# Altium project Vertical.PrjPCB
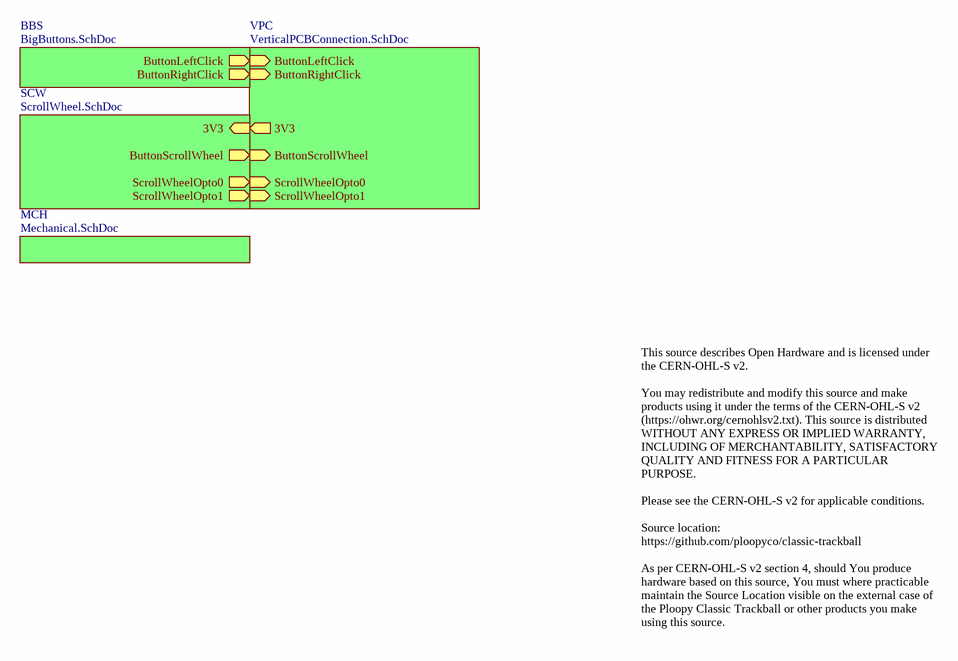
[diagram p0: Vertical.SchDoc]
5 sheets, 36 parts. Net scope: hierarchical (ports join the sheet entries above them; power ports are global).
Board file: Vertical.PcbDoc
Sheets:
  Vertical.SchDoc
    MCH = Mechanical.SchDoc
    VPC = VerticalPCBConnection.SchDoc
    BBS = BigButtons.SchDoc
    SCW = ScrollWheel.SchDoc

## Sheet Vertical.SchDoc
size Letter; Organization: Ploopy Corporation; Address1: 137-1140 Burnhamthorpe Road W; Address3: Ontario; DocumentNumber: 1; Revision: R1.007; SheetNumber: 1; SheetTotal: 5

### Sub-sheets
BBS = BigButtons.SchDoc: ButtonRightClick (out), ButtonLeftClick (out)
MCH = Mechanical.SchDoc: no entries
SCW = ScrollWheel.SchDoc: 3V3 (in), ScrollWheelOpto1 (out), ScrollWheelOpto0 (out), ButtonScrollWheel (out)
VPC = VerticalPCBConnection.SchDoc: 3V3 (out), ButtonRightClick (in), ButtonLeftClick (in), ScrollWheelOpto1 (in), ScrollWheelOpto0 (in), ButtonScrollWheel (in)

### Nets
3V3: sheet VPC/3V3, sheet SCW/3V3
NetCJ2_1: sheet VPC/ButtonScrollWheel, sheet SCW/ButtonScrollWheel
NetCJ3_1: sheet VPC/ScrollWheelOpto0, sheet SCW/ScrollWheelOpto0
NetCJ4_1: sheet VPC/ScrollWheelOpto1, sheet SCW/ScrollWheelOpto1
NetCJ6_1: sheet VPC/ButtonLeftClick, sheet BBS/ButtonLeftClick
NetCJ7_1: sheet VPC/ButtonRightClick, sheet BBS/ButtonRightClick

### Notes on the sheet
- This source describes Open Hardware and is licensed under the CERN-OHL-S v2.
  You may redistribute and modify this source and make products using it under the terms of the CERN-OHL-S v2 (https://ohwr.org/cernohlsv2.txt). This source is distributed WITHOUT ANY EXPRESS OR IMPLIED WARRANTY, INCLUDING OF MERCHANTABILITY, SATISFACTORY QUALITY AND FITNESS FOR A PARTICULAR PURPOSE.
  Please see the CERN-OHL-S v2 for applicable conditions.
  Source location:  https://github.com/ploopyco/classic-trackball
  As per CERN-OHL-S v2 section 4, should You produce hardware based on this source, You must where practicable maintain the Source Location visible on the external case of the Ploopy Classic Trackball or other products you make using this source.
- Copyright Ploopy Corporation 2024
- Licensed under the CERN-OHL-S v2
- http://ohwr.org/cernohl
- Title:
- PCB:
- Version:
- Ploopy Corporation
- Mississauga ON L5C 0A3
- 137-1140 Burnhamthorpe Road W
- Date:
- Time:
- Sheet
- of
- Canada

## Sheet Mechanical.SchDoc
size Letter; Organization: Ploopy Corporation; Address1: 137-1140 Burnhamthorpe Road W; Address3: Ontario; DocumentNumber: 3; Revision: R1.007; SheetNumber: 3; SheetTotal: 5
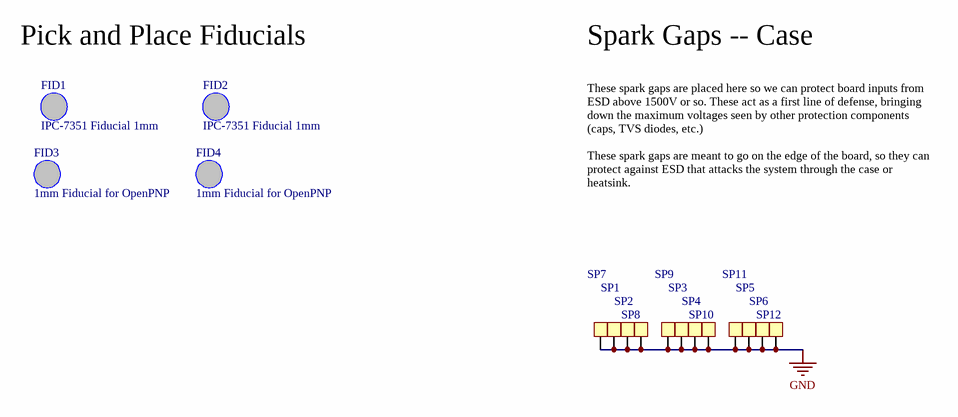
[diagram p1: Mechanical.SchDoc]

### Parts
FID1  IPC-7351 Fiducial 1mm  [FIDUCIAL_1.5]
FID2  IPC-7351 Fiducial 1mm  [FIDUCIAL_1.5]
FID3  1mm Fiducial for OpenPNP  [FIDUCIAL-NEW]
FID4  1mm Fiducial for OpenPNP  [FIDUCIAL-NEW]
SP1  Spark Gap  [SparkGap]  (value not drawn)  (no BOM)
SP2  Spark Gap  [SparkGap]  (value not drawn)  (no BOM)
SP3  Spark Gap  [SparkGap]  (value not drawn)  (no BOM)
SP4  Spark Gap  [SparkGap]  (value not drawn)  (no BOM)
SP5  Spark Gap  [SparkGap]  (value not drawn)  (no BOM)
SP6  Spark Gap  [SparkGap]  (value not drawn)  (no BOM)
SP7  Spark Gap  [SparkGap]  (value not drawn)  (no BOM)
SP8  Spark Gap  [SparkGap]  (value not drawn)  (no BOM)
SP9  Spark Gap  [SparkGap]  (value not drawn)  (no BOM)
SP10  Spark Gap  [SparkGap]  (value not drawn)  (no BOM)
SP11  Spark Gap  [SparkGap]  (value not drawn)  (no BOM)
SP12  Spark Gap  [SparkGap]  (value not drawn)  (no BOM)

### Nets
GND: SP1.1 SP2.1 SP3.1 SP4.1 SP5.1 SP6.1 SP7.1 SP8.1 SP9.1 SP10.1 SP11.1 SP12.1

Not connected (* = marked no-connect by the designer): FID1 1; FID2 1; FID3 1; FID4 1

### Notes on the sheet
- Pick and Place Fiducials
- Spark Gaps -- Case
- These spark gaps are placed here so we can protect board inputs from ESD above 1500V or so. These act as a first line of defense, bringing down the maximum voltages seen by other protection components (caps, TVS diodes, etc.)
  These spark gaps are meant to go on the edge of the board, so they can protect against ESD that attacks the system through the case or heatsink.
- Copyright Ploopy Corporation 2024
- Licensed under the CERN-OHL-S v2
- http://ohwr.org/cernohl
- Title:
- PCB:
- Version:
- Ploopy Corporation
- Mississauga ON L5C 0A3
- 137-1140 Burnhamthorpe Road W
- Date:
- Time:
- Sheet
- of
- Canada

### Library data of the parts
FID1 FID2 = FIDUCIAL_1.5: PNP-Nzl: 2; PNP-dx: 0; PNP-X: 4; PNP-A: 1; PNP-Thk: 1.02; PNP-TS: 70; PNP-Type: MARK1; PNP-dy: 0; PNP-Y: 4; PNP-Pt: 0; PNP-W: 0; PNP-Lv: 1; PNP-Level: 1; PNP-Voff: 0; PNP-FeedType: Fiducial; PNP-TapeWidth: 0; PNP-PlacePriority: 0; PNP-TapeIndex: 0; PNP-da: 0
FID3 FID4 = FIDUCIAL_NEW: This fiducial is designed to work with OpenPNP. It presents a circular pattern under the solder mask, to prevent glare issues from messing with the detection.; PNP-Nzl: 2; PNP-dx: 0; PNP-X: 4; PNP-A: 1; PNP-Thk: 1.02; PNP-TS: 70; PNP-Type: MARK1; PNP-dy: 0; PNP-Y: 4; PNP-Pt: 0; PNP-W: 0; PNP-Lv: 1; PNP-Level: 1; PNP-Voff: 0; PNP-FeedType: Fiducial; PNP-TapeWidth: 0; PNP-PlacePriority: 0; PNP-TapeIndex: 0; PNP-da: 0
SP1-SP12 = Spark Gap: Open square pad for spark gapping

## Sheet VerticalPCBConnection.SchDoc
size Letter; Organization: Ploopy Corporation; Address1: 137-1140 Burnhamthorpe Road W; Address3: Ontario; DocumentNumber: 5; Revision: R1.007; SheetNumber: 5; SheetTotal: 5
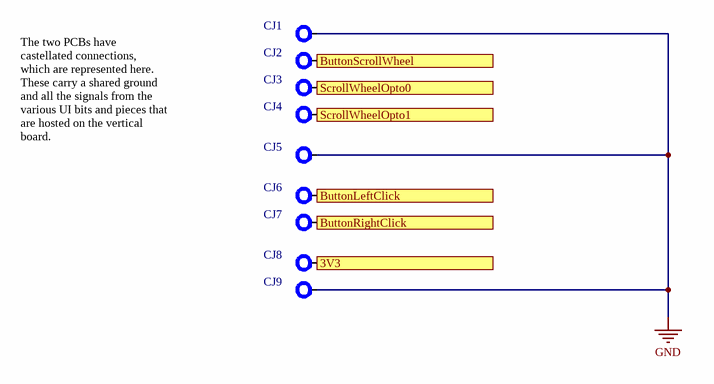
[diagram p2: VerticalPCBConnection.SchDoc]

### Parts
CJ1  PCBJointCastellationJoint  [PCBJoint]  (value not drawn)  (no BOM)
CJ2  PCBJointCastellationJoint  [PCBJoint]  (value not drawn)  (no BOM)
CJ3  PCBJointCastellationJoint  [PCBJoint]  (value not drawn)  (no BOM)
CJ4  PCBJointCastellationJoint  [PCBJoint]  (value not drawn)  (no BOM)
CJ5  PCBJointCastellationJoint  [PCBJoint]  (value not drawn)  (no BOM)
CJ6  PCBJointCastellationJoint  [PCBJoint]  (value not drawn)  (no BOM)
CJ7  PCBJointCastellationJoint  [PCBJoint]  (value not drawn)  (no BOM)
CJ8  PCBJointCastellationJoint  [PCBJoint]  (value not drawn)  (no BOM)
CJ9  PCBJointCastellationJoint  [PCBJoint]  (value not drawn)  (no BOM)

### Ports
3V3 (out), ButtonLeftClick (in), ButtonRightClick (in), ButtonScrollWheel (in), ScrollWheelOpto0 (in), ScrollWheelOpto1 (in)

### Nets
GND: CJ1.1 CJ5.1 CJ9.1
3V3: CJ8.1 ; port 3V3
NetCJ2_1: CJ2.1 ; port ButtonScrollWheel
NetCJ3_1: CJ3.1 ; port ScrollWheelOpto0
NetCJ4_1: CJ4.1 ; port ScrollWheelOpto1
NetCJ6_1: CJ6.1 ; port ButtonLeftClick
NetCJ7_1: CJ7.1 ; port ButtonRightClick

### Notes on the sheet
- The two PCBs have castellated connections, which are represented here. These carry a shared ground and all the signals from the various UI bits and pieces that are hosted on the vertical board.
- Copyright Ploopy Corporation 2024
- Licensed under the CERN-OHL-S v2
- http://ohwr.org/cernohl
- Title:
- PCB:
- Version:
- Ploopy Corporation
- Mississauga ON L5C 0A3
- 137-1140 Burnhamthorpe Road W
- Date:
- Time:
- Sheet
- of
- Canada

### Library data of the parts
CJ1-CJ9 = PCBJoint: Pad for soldering a castellated PCB edge. Easy way to join two PCBs together.

## Sheet BigButtons.SchDoc
size Letter; Organization: Ploopy Corporation; Address1: 137-1140 Burnhamthorpe Road W; Address3: Ontario; DocumentNumber: 2; Revision: R1.007; SheetNumber: 2; SheetTotal: 5
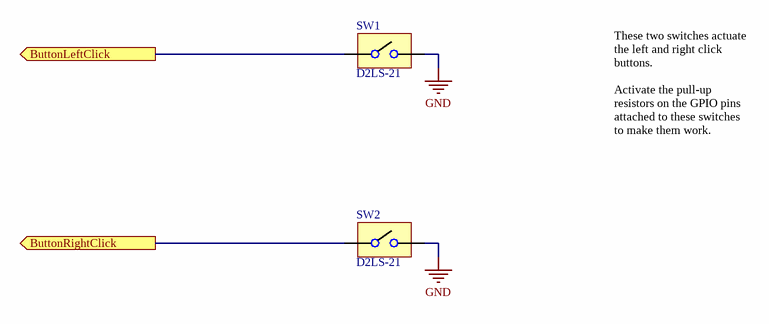
[diagram p3: BigButtons.SchDoc]

### Parts
SW1  D2LS-21  [D2LS-21]
SW2  D2LS-21  [D2LS-21]

### Ports
ButtonLeftClick (out), ButtonRightClick (out)

### Nets
GND: SW1.B SW2.B
NetCJ6_1: SW1.A ; port ButtonLeftClick
NetCJ7_1: SW2.A ; port ButtonRightClick

### Notes on the sheet
- These two switches actuate the left and right click buttons.
  Activate the pull-up resistors on the GPIO pins attached to these switches to make them work.
- Copyright Ploopy Corporation 2024
- Licensed under the CERN-OHL-S v2
- http://ohwr.org/cernohl
- Title:
- PCB:
- Version:
- Ploopy Corporation
- Mississauga ON L5C 0A3
- 137-1140 Burnhamthorpe Road W
- Date:
- Time:
- Sheet
- of
- Canada

### Library data of the parts
SW1 SW2 = D2LS-21: Compact Surface-mounting Switch for long durability; Supplier 1: Digi-Key; Supplier 2: Mouser; Supplier Part Number 1: Z4378CT-ND; Supplier Part Number 2: 653-D2LS-21

## Sheet ScrollWheel.SchDoc
size Letter; Organization: Ploopy Corporation; Address1: 137-1140 Burnhamthorpe Road W; Address3: Ontario; DocumentNumber: 4; Revision: R1.007; SheetNumber: 4; SheetTotal: 5
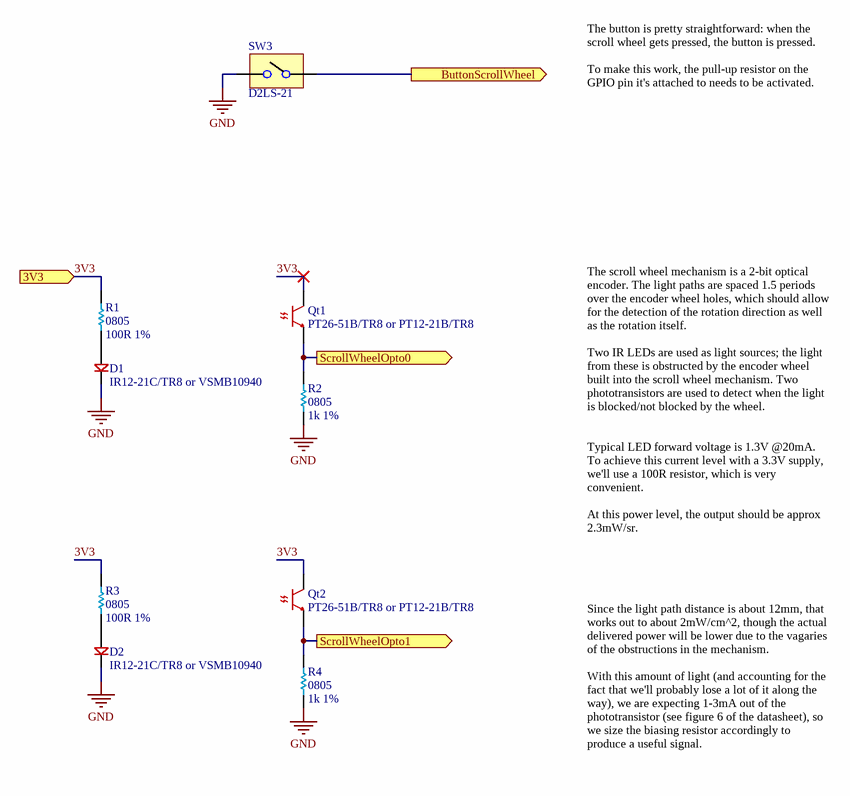
[diagram p4: ScrollWheel.SchDoc]

### Parts
D1  IR12-21C/TR8 or VSMB10940  [IR12-21C/TR8]
D2  IR12-21C/TR8 or VSMB10940  [IR12-21C/TR8]
Qt1  PT26-51B/TR8 or PT12-21B/TR8  [PT26-51B/TR8]
Qt2  PT26-51B/TR8 or PT12-21B/TR8  [PT26-51B/TR8]
R1  0805  value 100R 1%  [0805]
R2  0805  value 1k 1%  [0805]
R3  0805  value 100R 1%  [0805]
R4  0805  value 1k 1%  [0805]
SW3  D2LS-21  [D2LS-21]

### Ports
3V3 (in), ButtonScrollWheel (out), ScrollWheelOpto0 (out), ScrollWheelOpto1 (out)

### Nets
GND: D1.C D2.C R2.1 R4.1 SW3.B
3V3: Qt1.C Qt2.C R1.2 R3.2 ; port 3V3
NetCJ2_1: SW3.A ; port ButtonScrollWheel
NetCJ3_1: Qt1.E R2.2 ; port ScrollWheelOpto0
NetCJ4_1: Qt2.E R4.2 ; port ScrollWheelOpto1
NetD1_A: D1.A R1.1
NetD2_A: D2.A R3.1

### Notes on the sheet
- The button is pretty straightforward: when the scroll wheel gets pressed, the button is pressed.
  To make this work, the pull-up resistor on the GPIO pin it's attached to needs to be activated.
- The scroll wheel mechanism is a 2-bit optical encoder. The light paths are spaced 1.5 periods over the encoder wheel holes, which should allow for the detection of the rotation direction as well as the rotation itself.
  Two IR LEDs are used as light sources; the light from these is obstructed by the encoder wheel built into the scroll wheel mechanism. Two phototransistors are used to detect when the light is blocked/not blocked by the wheel.
  Typical LED forward voltage is 1.3V @20mA. To achieve this current level with a 3.3V supply, we'll use a 100R resistor, which is very convenient.
  At this power level, the output should be approx 2.3mW/sr.
  Since the light path distance is about 12mm, that works out to about 2mW/cm^2, though the actual delivered power will be lower due to the vagaries of the obstructions in the mechanism.
  With this amount of light (and accounting for the fact that we'll probably lose a lot of it along the way), we are expecting 1-3mA out of the phototransistor (see figure 6 of the datasheet), so we size the biasing resistor accordingly to produce a useful signal.
- Copyright Ploopy Corporation 2024
- Licensed under the CERN-OHL-S v2
- http://ohwr.org/cernohl
- Title:
- PCB:
- Version:
- Ploopy Corporation
- Mississauga ON L5C 0A3
- 137-1140 Burnhamthorpe Road W
- Date:
- Time:
- Sheet
- of
- Canada

### Library data of the parts
D1 D2 = IR12-21C/TR8: Infrared (IR) Emitter 880nm 1.3V 50mA 1mW/sr @ 20mA 30° 2-SMD, No Lead; Supplier 1: Digi-Key; Supplier 2: Mouser; Supplier 3: Digi-Key; Supplier 4: Mouser; Supplier 5: Arrow; Supplier Part Number 1: 1080-1351-1-ND; Supplier Part Number 2: 638-IR12-21C; Supplier Part Number 3: VSMB10940CT-ND; Supplier Part Number 4: 78-VSMB10940; Supplier Part Number 5: VSMB10940
Qt1 Qt2 = PT26-51B/TR8: Phototransistor 940nm Side View 1206 (3216 Metric); Supplier 1: Digi-Key; Supplier Part Number 1: 1080-1387-1-ND; Supplier 2: Digi-Key; Supplier Part Number 2: 1080-1377-1-ND
R1 R3 = Res 100R 1% 0805: Chip resistor; Supplier 1: Digi-Key; Supplier 2: Digi-Key; Supplier Part Number 1: RMCF0805FT100RCT-ND; Supplier Part Number 2: RMCF0805FT100RTR-ND
R2 R4 = Res 1k 1% 0805: Chip resistor, 1/8W 100PPM; Supplier 1: Digi-Key; Supplier Part Number 1: RMCF0805FT1K00TR-ND
SW3 = D2LS-21: as SW1 on sheet BigButtons; Supplier 1: Digi-Key; Supplier 2: Mouser; Supplier Part Number 1: Z4378CT-ND; Supplier Part Number 2: 653-D2LS-21

## Nets that join several sheets
GND: Mechanical (12 pins), VerticalPCBConnection (CJ1.1 CJ5.1 CJ9.1), BigButtons (SW1.B SW2.B), ScrollWheel (5 pins)
3V3: VerticalPCBConnection (CJ8.1), ScrollWheel (Qt1.C Qt2.C R1.2 R3.2)
NetCJ2_1: VerticalPCBConnection (CJ2.1), ScrollWheel (SW3.A)
NetCJ3_1: VerticalPCBConnection (CJ3.1), ScrollWheel (Qt1.E R2.2)
NetCJ4_1: VerticalPCBConnection (CJ4.1), ScrollWheel (Qt2.E R4.2)
NetCJ6_1: VerticalPCBConnection (CJ6.1), BigButtons (SW1.A)
NetCJ7_1: VerticalPCBConnection (CJ7.1), BigButtons (SW2.A)